# Altium schematic sheet 02_Power_Diagram.SchDoc
size A; SheetNumber: 2; SheetTotal: 7
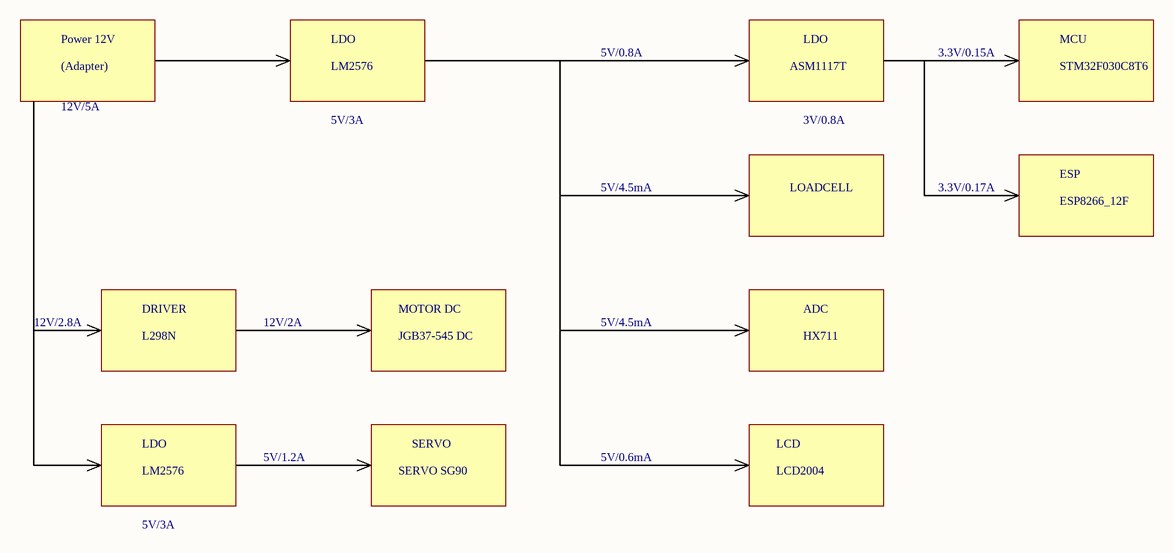
[diagram p0: 02_Power_Diagram.SchDoc]

## Notes on the sheet
- Power 12V
- LDO
- MCU
- (Adapter)
- 12V/5A
- LM2576
- 5V/0.8A
- ASM1117T
- 3.3V/0.15A
- STM32F030C8T6
- 5V/3A
- 3V/0.8A
- ESP
- 5V/4.5mA
- LOADCELL
- 3.3V/0.17A
- ESP8266_12F
- DRIVER
- MOTOR DC
- ADC
- 12V/2.8A
- L298N
- 12V/2A
- JGB37-545 DC
- HX711
- SERVO
- LCD
- 5V/1.2A
- SERVO SG90
- 5V/0.6mA
- LCD2004